# Altium project vme6U_carrier_Cyc_V_SoC.PrjPcb (part 8 of 8)

## Sheet Buffers.DiagrammaStrutturale.SchDoc
size 420 x 297 mm; Address1: Address1; Address2: Address2; Address3: Address3; Address4: Address4; SheetNumber: 1; Scale: 1:1; Разраб.: Иванов; Обозначение документа: АБВГ.123456.001 Э3; Пров.: Петров; Утв.: Сидоров; Наименование организации: ОАО "Концерн "МПО-Гидроприбор"; Перв. применение: АБВГ.123456.000; Наименование изделия 1: Плата; Наименование изделия 2: Схема электрическая; Наименование изделия 3: принципиальная; Нач. отд.: Нач. отд.; Фамилия нач. отд.: Сидоров
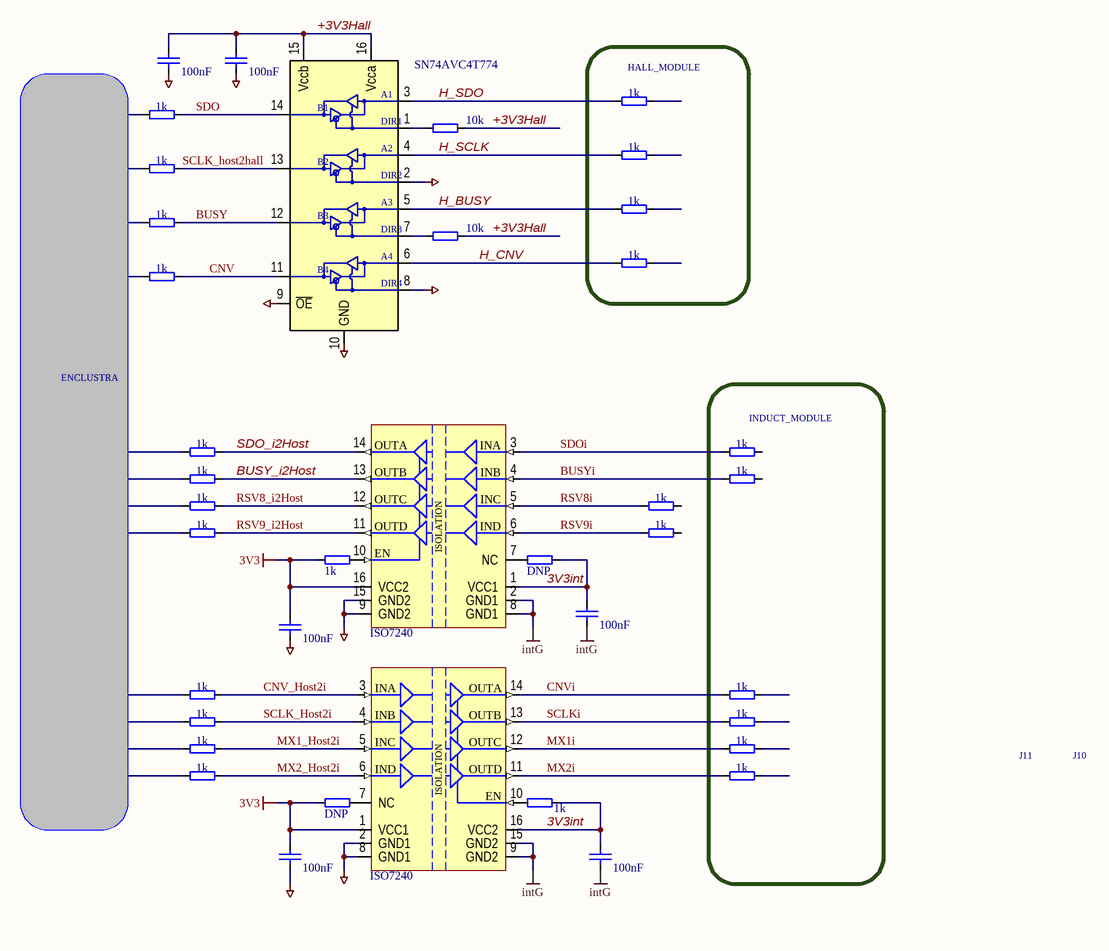
[diagram p27: Buffers.DiagrammaStrutturale.SchDoc]

### Parts
(Parts that share a designator on the sheet are numbered #1, #2 ... from top to bottom, then left to right.)
C?#1  100nF  [SMD0805CAP]
C?#2  100nF  [SMD0805CAP]
C?#3  100nF  [SMD0805CAP]
C?#4  100nF  [SMD0805CAP]
C?#5  100nF  [SMD0805CAP]
C?#6  100nF  [SMD0805CAP]
R?#1  1k  [SMD0805RES]
R?#2  1k  [SMD0805RES]
R?#3  10k  [SMD0805RES]
R?#4  1k  [SMD0805RES]
R?#5  1k  [SMD0805RES]
R?#6  1k  [SMD0805RES]
R?#7  1k  [SMD0805RES]
R?#8  10k  [SMD0805RES]
R?#9  1k  [SMD0805RES]
R?#10  1k  [SMD0805RES]
R?#11  1k  [SMD0805RES]
R?#12  1k  [SMD0805RES]
R?#13  1k  [SMD0805RES]
R?#14  1k  [SMD0805RES]
R?#15  1k  [SMD0805RES]
R?#16  1k  [SMD0805RES]
R?#17  1k  [SMD0805RES]
R?#18  1k  [SMD0805RES]
R?#19  1k  [SMD0805RES]
R?#20  DNP  [SMD0805RES]
R?#21  1k  [SMD0805RES]
R?#22  1k  [SMD0805RES]
R?#23  1k  [SMD0805RES]
R?#24  1k  [SMD0805RES]
R?#25  1k  [SMD0805RES]
R?#26  1k  [SMD0805RES]
R?#27  1k  [SMD0805RES]
R?#28  1k  [SMD0805RES]
R?#29  DNP  [SMD0805RES]
R?#30  1k  [SMD0805RES]
U?#1  SN74AVC4T774  [TSSOP-16]
U?#2  ISO7240  [SOIC127P1030X265-16N]
U?#3  ISO7240  [SOIC127P1030X265-16N]

### Blocks framed on the sheet
HALL_MODULE: R?#1 R?#4 R?#6 R?#9
INDUCT_MODULE: R?#12 R?#14 R?#22 R?#24 R?#26 R?#28

### Nets
3V3: C?#4.2 C?#5.2 R?#19.1 R?#29.1 U?#2.16(VCC2) U?#3.1(VCC1)
GND: C?#1.1 C?#2.1 C?#4.1 C?#5.1 U?#1.2(DIR2) U?#1.8(DIR4) U?#1.9(~{OE}) U?#1.10(GND) U?#2.9(GND2) U?#2.15(GND2) U?#3.2(GND1) U?#3.8(GND1)
intG: C?#3.1 C?#6.1 U?#2.2(GND1) U?#2.8(GND1) U?#3.9(GND2) U?#3.15(GND2)
3V3int: C?#3.2 C?#6.2 R?#20.2 R?#30.2 U?#2.1(VCC1) U?#3.16(VCC2)
+3V3Hall: C?#1.2 C?#2.2 R?#3.1 R?#8.1 U?#1.15(Vccb) U?#1.16(Vcca)
BUSY: R?#7.1 U?#1.12(B3)
BUSY_i2Host: R?#13.1 U?#2.13(OUTB)
BUSYi: R?#14.2 U?#2.4(INB)
CNV: R?#10.1 U?#1.11(B4)
CNV_Host2i: R?#21.1 U?#3.3(INA)
CNVi: R?#22.2 U?#3.14(OUTA)
H_BUSY: R?#6.2 U?#1.5(A3)
H_CNV: R?#9.2 U?#1.6(A4)
H_SCLK: R?#4.2 U?#1.4(A2)
H_SDO: R?#1.2 U?#1.3(A1)
MX1_Host2i: R?#25.1 U?#3.5(INC)
MX1i: R?#26.2 U?#3.12(OUTC)
MX2_Host2i: R?#27.1 U?#3.6(IND)
MX2i: R?#28.2 U?#3.11(OUTD)
RSV8_i2Host: R?#15.1 U?#2.12(OUTC)
RSV8i: R?#16.2 U?#2.5(INC)
RSV9_i2Host: R?#17.1 U?#2.11(OUTD)
RSV9i: R?#18.2 U?#2.6(IND)
SCLK_host2hall: R?#5.1 U?#1.13(B2)
SCLK_Host2i: R?#23.1 U?#3.4(INB)
SCLKi: R?#24.2 U?#3.13(OUTB)
SDO: R?#2.1 U?#1.14(B1)
SDO_i2Host: R?#11.1 U?#2.14(OUTA)
SDOi: R?#12.2 U?#2.3(INA)
NetR?#3_2: R?#3.2 U?#1.1(DIR1)
NetR?#8_2: R?#8.2 U?#1.7(DIR3)
NetR?#19_2: R?#19.2 U?#2.10(EN)
NetR?#20_1: R?#20.1 U?#2.7(NC)
NetR?#29_2: R?#29.2 U?#3.7(NC)
NetR?#30_1: R?#30.1 U?#3.10(EN)

Not connected (* = marked no-connect by the designer): R?#1 1; R?#2 2; R?#4 1; R?#5 2; R?#6 1; R?#7 2; R?#9 1; R?#10 2; R?#11 2; R?#12 1; R?#13 2; R?#14 1; R?#15 2; R?#16 1; R?#17 2; R?#18 1; R?#21 2; R?#22 1; R?#23 2; R?#24 1; R?#25 2; R?#26 1; R?#27 2; R?#28 1

### Notes on the sheet
- ENCLUSTRA
- J11
- J10
- Подп. и дата
- Инв. № дубл.
- Взам. инв. №
- Инв. № подл.
- Изм.
- Лист
- № докум.
- Подп.
- Дата
- Копировал
- Формат А3
- (in symbol ISO7240M) ISOLATION

### Library data of the parts
C?#1-C?#6 = C0805: Чип конденсатор 0805; Voltage: 25V; Vendor: Vishay; DielectricType: X5R; SMD Solders: 2; Solder Option: RM; Tolerance: 20%; Pkg: SMD0805; Device: Cap0805; Value: 100nF; Price: 2
R?#1-R?#18 R?#20-R?#29 = R0805: Чип резистор 0805; Vendor: Vishay; SMD Solders: 2; Solder Option: i; TC: 100ppm/C; Tolerance: 1%; Pkg: SMD0805; Pwr: 125mW; Device: Res0805; Price: 2
  R?#1 R?#2 R?#4-R?#7 R?#9-R?#18 R?#21-R?#28: Value: 1k
  R?#3 R?#8: Value: 10k
  R?#20 R?#29: Value: DNP
R?#19 R?#30 = R0805: Чип резистор 0805; Vendor: Vishay; SMD Solders: 2; Solder Option: RM; TC: 100ppm/C; Tolerance: 1%; Pkg: SMD0805; Pwr: 125mW; Device: Res0805; Price: 2; Value: 1k
U?#1 = SN74AVC4T774: Двунаправленный буфер; Pkg: TSSOP16; SMD Solders: 16; Solder Option: RM; THD Solders: 0; Vendor: Texas Instruments; Voltage: 1V1.. 3.6V  I/Os are 4.6-V Tolerant; Name to order: SN74AVC4T774PW; Device: SN74AVC4T774; Price: 300
U?#2 U?#3 = ISO7240M: Двунаправленный буфер; Pkg: SOIC16DW; SMD Solders: 16; Solder Option: RM; THD Solders: 0; Vendor: Texas Instruments; Voltage: 3V3 or 5V; Name to order: ISO7240MDWR; Current: 30; Device: ISO7240; Price: 3500

## Nets that join several sheets
3V3RF: RFCtl (11 pins), DCDC_Hall (L32.2), Integrator (14 pins), DCDC_DDS (L42.2), DCDC_Slow (L75.2)
+1V8MOD: main (TP1.1), cyc_v_som_B (J3.B52 J3.B76 J3.B108 J3.B128)
+2V5MOD: main (TP12.1), cyc_v_som_A (J3.A53 J3.A62 J3.A65 J3.A89), cyc_v_som_B (6 pins), cyc_v_som_C (6 pins), Si5395_CLK_GEN (20 pins)
+3.3VD: main (39 pins), cyc_v_som_A (J3.A38 J3.A41 J3.A74 J3.A77), ethernet_1gbe_ext_magn (R46.1 R77.1), ethernet_dual_100mbe_ext_magn (R82#1.1 R94.1), uart_adm3222 (C80.2 R62.2 U19#1.19), jtag (7 pins), sdcard_emmc (44 pins), U_can_phy (C106_U_can_phy#1.2 U9_U_can_phy#1.1), U_can_phy (C106_U_can_phy#2.2 U9_U_can_phy#2.1), U_SFPplusConn_0 (11 pins), U_SFPplusConn_1 (11 pins), U_SFPplusConn_2 (11 pins), U_SFPplusConn_3 (11 pins), Si5395_CLK_GEN (22 pins), power_REG104GA_1V8 (C148#1.2 C151#1.2 U36#1.1)
+3V3MOD: main (C128.2 TP11.1 U26#1.14), cyc_v_som_A (J3.A26 J3.A29 J3.A50 J3.A86), cyc_v_som_B (6 pins), cyc_v_som_C (J3.C96 J3.C103 J3.C136 J3.C143)
+5VME: cyc_v_som_A (10 pins), U_can_phy (C109_U_can_phy#1.2 C110_U_can_phy#1.2 U10_U_can_phy#1.1), U_can_phy (C109_U_can_phy#2.2 C110_U_can_phy#2.2 U10_U_can_phy#2.1), Si5395_CLK_GEN (R182#1.2), power_REG104GA_3V3 (C156.2 C157#1.2 U37#1.1), RFCtl (13 pins), DCDC_Hall (10 pins), RF_Ctl/RF_H/H_DCDC/DCP_H- (C7_DCP_H-.2 L17_DCP_H-.1 R19_DCP_H-.1 R25_DCP_H-.1), RF_Ctl/RF_i/i_DCDC/DCP_i- (C7_DCP_i-.2 L17_DCP_i-.1 R19_DCP_i-.1 R25_DCP_i-.1), RF_Ctl/RF_i/i_DCDC/DCP_i+ (C7_DCP_i+.2 L17_DCP_i+.1 R19_DCP_i+.1 R25_DCP_i+.1), DCDC_DDS (7 pins), RF_Ctl/RF_D/D_DCDC/DCP_D+ (C7_DCP_D+.2 L17_DCP_D+.1 R19_DCP_D+.1 R25_DCP_D+.1), RF_Ctl/RF_D/D_DCDC/DCP_D- (C7_DCP_D-.2 L17_DCP_D-.1 R19_DCP_D-.1 R25_DCP_D-.1), DCDC_Slow (15 pins), RF_Ctl/RF_S/S_DCDC/DCP_S+ (C7_DCP_S+.2 L17_DCP_S+.1 R19_DCP_S+.1 R25_DCP_S+.1), RF_Ctl/RF_S/S_DCDC/DCP_S- (C7_DCP_S-.2 L17_DCP_S-.1 R19_DCP_S-.1 R25_DCP_S-.1)
+12Vin: DCDC_Hall (7 pins), DCDC_int (5 pins), DCDC_DDS (Q19.2 R240.2), DCDC_Slow (7 pins)
intG: Integrator (37 pins), DCDC_int (35 pins), RF_Ctl/RF_i/i_DCDC/DCP_i- (C9_DCP_i-.2 C13_DCP_i-.2 U3_DCP_i-.13), RF_Ctl/RF_i/i_DCDC/DCP_i+ (C9_DCP_i+.2 C13_DCP_i+.2 U3_DCP_i+.13)
MGND: main (8 pins), ethernet_1gbe_ext_magn (C88#1.1 C89.1 J11.S1 J11.S2), ethernet_dual_100mbe_ext_magn (C111.2 C118.1 J13.S1 J13.S2), uart_adm3222 (J1#1.0)
POK_int: main (84 pins), cyc_v_som_A (29 pins), cyc_v_som_B (37 pins), cyc_v_som_C (41 pins), ethernet_1gbe_ext_magn (7 pins), ethernet_dual_100mbe_ext_magn (7 pins), uart_adm3222 (7 pins), jtag (C81#1.1 J2.10 R171.2 U20.2), sdcard_emmc (33 pins), U_can_phy (5 pins), U_can_phy (5 pins), Power_3V3_LDO (C133.1 C134.1 U28.2), U_SFPplusConn_0 (31 pins), U_SFPplusConn_1 (31 pins), U_SFPplusConn_2 (31 pins), U_SFPplusConn_3 (31 pins), Si5395_CLK_GEN (63 pins), power_REG104GA_1V8 (8 pins), power_REG104GA_3V3 (8 pins), RFCtl (38 pins), Hall (62 pins), DCDC_Hall (41 pins), RF_Ctl/RF_H/H_DCDC/DCP_H- (12 pins), Integrator (17 pins), DCDC_int (9 pins), RF_Ctl/RF_i/i_DCDC/DCP_i- (9 pins), RF_Ctl/RF_i/i_DCDC/DCP_i+ (9 pins), DDS (83 pins), DCDC_DDS (21 pins), RF_Ctl/RF_D/D_DCDC/DCP_D+ (12 pins), RF_Ctl/RF_D/D_DCDC/DCP_D- (12 pins), SlowChans (196 pins), DCDC_Slow (49 pins), RF_Ctl/RF_S/S_DCDC/DCP_S+ (12 pins), RF_Ctl/RF_S/S_DCDC/DCP_S- (12 pins)
VBUT: main (C132.2 R98#1.1), cyc_v_som_A (J3.A168)
3V3BATLDO: main (D4.1), Power_3V3_LDO (C134.2 R101#1.2 U28.5)
3V3DDS: DDS (31 pins), DCDC_DDS (Q24.3 R225.2)
3V3SL: SlowChans (106 pins), DCDC_Slow (Q41.3 R401.2)
12DDS: DDS (L38.2), DCDC_DDS (Q19.3 R216.2)
+3V3Hall: Hall (28 pins), DCDC_Hall (Q11.3 R82#2.2)
+5SL: SlowChans (6 pins), DCDC_Slow (Q44.3 R405.2)
+7_: DCDC_Slow (R513.2), RF_Ctl/RF_S/S_DCDC/DCP_S+ (C9_DCP_S+.2 C13_DCP_S+.2 U3_DCP_S+.13)
+7D: DCDC_DDS (Q21.2 R251.2 R525.1), RF_Ctl/RF_D/D_DCDC/DCP_D+ (C9_DCP_D+.2 C13_DCP_D+.2 U3_DCP_D+.13)
+7DDS: DDS (L35.2 L96.2), DCDC_DDS (Q21.3 R219.2)
+7H: DCDC_int (R314.2), RF_Ctl/RF_i/i_DCDC/DCP_i+ (C9_DCP_i+.1 C13_DCP_i+.1 U3_DCP_i+.12)
+7int: Integrator (L48.2 L99.2 L850.1), DCDC_int (Q29.3 R265.2)
+7SL: SlowChans (6 pins), DCDC_Slow (Q38.3 R394.2)
+12Hall: Hall (L28.2), DCDC_Hall (Q9.3 R67#2.2)
+12SL: SlowChans (L59.2 L70.2 L80.2), DCDC_Slow (Q37.3 R391.2)
+18Hall: Hall (L30.2), DCDC_Hall (Q5.3 R89#2.2)
+18int: Integrator (L46.2), DCDC_int (Q32.3 R321.2)
+18SL: SlowChans (L54.2 L65.2 L76.2), DCDC_Slow (Q51.3 R383.2)
-7_: DCDC_Slow (Q45.2 R388.1 R452.2), RF_Ctl/RF_S/S_DCDC/DCP_S- (C9_DCP_S-.1 C13_DCP_S-.1 U3_DCP_S-.12)
-7D: DCDC_DDS (Q15.2 R221.2 R231.1), RF_Ctl/RF_D/D_DCDC/DCP_D- (C9_DCP_D-.1 C13_DCP_D-.1 U3_DCP_D-.12)
-7DDS: DDS (L37.2 L93.2), DCDC_DDS (Q15.3 R222.2)
-7H: DCDC_Hall (Q4.2 R78#2.2 R101#2.1), RF_Ctl/RF_H/H_DCDC/DCP_H- (C9_DCP_H-.1 C13_DCP_H-.1 U3_DCP_H-.12)
-7Hall: Hall (L27.2 L86.2), DCDC_Hall (Q4.3 R6.2)
-7i: DCDC_int (Q26.2 R272.2 R274.2), RF_Ctl/RF_i/i_DCDC/DCP_i- (C9_DCP_i-.1 C13_DCP_i-.1 U3_DCP_i-.12)
-7int: Integrator (L50.2 L95.2), DCDC_int (Q26.3 R267.2)
-7SL: SlowChans (5 pins), DCDC_Slow (Q45.3 R408.2)
-18Hall: Hall (L29.2), DCDC_Hall (Q7.3 R114#2.2)
-18int: Integrator (L47.2), DCDC_int (Q31.3 R276.2)
-18SL: SlowChans (L55.2 L66.2 L77.2), DCDC_Slow (Q49.3 R386.2)
~{En}: RFCtl (U70.8 U70.13), DCDC_Hall (Q13.1), DCDC_int (R260.1), DCDC_DDS (Q16.1), DCDC_Slow (Q47.1)
BOOT_MODE0: main (J10.7), cyc_v_som_A (J3.A126)
BOOT_MODE1: main (J10.8), cyc_v_som_A (J3.A112)
CAN0_G: main (J9.3), U_can_phy (L15_U_can_phy#1.1)
CAN0_H: main (J9.7), U_can_phy (L14_U_can_phy#1.1)
CAN0_L: main (J9.2), U_can_phy (L14_U_can_phy#1.4)
CAN0_RX: cyc_v_som_A (J3.A88), U_can_phy (R29_U_can_phy#1.2)
CAN0_TX: cyc_v_som_A (J3.A90), U_can_phy (R33_U_can_phy#1.2)
CAN1_G: main (J9.4), U_can_phy (L15_U_can_phy#2.1)
CAN1_H: main (J9.8), U_can_phy (L14_U_can_phy#2.1)
CAN1_L: main (J9.1), U_can_phy (L14_U_can_phy#2.4)
CAN1_RX: cyc_v_som_A (J3.A104), U_can_phy (R29_U_can_phy#2.2)
CAN1_TX: cyc_v_som_A (J3.A106), U_can_phy (R33_U_can_phy#2.2)
Clock_hDCP-: RFCtl (U74.3), RF_Ctl/RF_H/H_DCDC/DCP_H- (Q10_DCP_H-.1 R19_DCP_H-.2)
Clock_iDCP+: RFCtl (U69.3), RF_Ctl/RF_i/i_DCDC/DCP_i+ (Q10_DCP_i+.1 R19_DCP_i+.2)
Clock_iDCP-: RFCtl (U69.6), RF_Ctl/RF_i/i_DCDC/DCP_i- (Q10_DCP_i-.1 R19_DCP_i-.2)
D_POK: DDS (R810.2), DCDC_DDS (7 pins)
DDS_CLK_N: Si5395_CLK_GEN (U35.23), DDS (C79#2.1 R258.1)
DDS_CLK_P: Si5395_CLK_GEN (U35.24), DDS (C76#2.1 R258.2)
EN_3V3: main (U26#1.6), RFCtl (J45.1)
ETH0_A_N: cyc_v_som_A (J3.A163), ethernet_1gbe_ext_magn (L13.3 U18.1)
ETH0_A_P: cyc_v_som_A (J3.A165), ethernet_1gbe_ext_magn (L13.2 U18.3)
ETH0_B_N: cyc_v_som_A (J3.A157), ethernet_1gbe_ext_magn (L13.6 U18.4)
ETH0_B_P: cyc_v_som_A (J3.A159), ethernet_1gbe_ext_magn (L13.5 U18.6)
ETH0_C_N: cyc_v_som_A (J3.A151), ethernet_1gbe_ext_magn (L13.9 U21#1.1)
ETH0_C_P: cyc_v_som_A (J3.A153), ethernet_1gbe_ext_magn (L13.8 U21#1.3)
ETH0_CTREF: cyc_v_som_A (J3.A155), ethernet_1gbe_ext_magn (5 pins)
ETH0_D_N: cyc_v_som_A (J3.A145), ethernet_1gbe_ext_magn (L13.12 U21#1.4)
ETH0_D_P: cyc_v_som_A (J3.A147), ethernet_1gbe_ext_magn (L13.11 U21#1.6)
ETH0_LED1: cyc_v_som_A (J3.A149), ethernet_1gbe_ext_magn (J11.9)
ETH0_LED2: cyc_v_som_A (J3.A161), ethernet_1gbe_ext_magn (J11.11)
ETH1_CTREF: cyc_v_som_A (J3.A154), ethernet_dual_100mbe_ext_magn (5 pins)
ETH1_LED1: cyc_v_som_A (J3.A160), ethernet_dual_100mbe_ext_magn (J13.9B)
ETH1_LED2: cyc_v_som_A (J3.A148), ethernet_dual_100mbe_ext_magn (J13.9A)
ETH1A_RX_N: cyc_v_som_A (J3.A156), ethernet_dual_100mbe_ext_magn (L8.6 U22.4)
ETH1A_RX_P: cyc_v_som_A (J3.A158), ethernet_dual_100mbe_ext_magn (L8.5 U22.6)
ETH1A_TX_N: cyc_v_som_A (J3.A162), ethernet_dual_100mbe_ext_magn (L8.3 U22.1)
ETH1A_TX_P: cyc_v_som_A (J3.A164), ethernet_dual_100mbe_ext_magn (L8.2 U22.3)
ETH1B_RX_N: cyc_v_som_A (J3.A144), ethernet_dual_100mbe_ext_magn (L8.12 U23.4)
ETH1B_RX_P: cyc_v_som_A (J3.A146), ethernet_dual_100mbe_ext_magn (L8.11 U23.6)
ETH1B_TX_N: cyc_v_som_A (J3.A150), ethernet_dual_100mbe_ext_magn (L8.9 U23.1)
ETH1B_TX_P: cyc_v_som_A (J3.A152), ethernet_dual_100mbe_ext_magn (L8.8 U23.3)
FCKO_N: main (C187.1), cyc_v_som_C (J3.C163)
FCKO_P: main (C186.1), cyc_v_som_C (J3.C161)
FPGA_CONFDONE: main (U26#1.1), cyc_v_som_A (J3.A130)
GPIO51: main (TP2.1), cyc_v_som_A (J3.A82)
GPIO52: main (TP4.1), cyc_v_som_A (J3.A84)
GPIO57: main (R35.1), cyc_v_som_A (J3.A98)
GPIO58: main (TP6.1), cyc_v_som_A (J3.A100)
GPIO63: main (TP8.1), cyc_v_som_A (J3.A92)
GPIO64: main (TP10.1), cyc_v_som_A (J3.A94)
GTP_REF0.IO_N: cyc_v_som_B (J3.B6), Si5395_CLK_GEN (C197.2)
GTP_REF0.IO_P: cyc_v_som_B (J3.B4), Si5395_CLK_GEN (C196#1.2)
GTP_REF1.IO_N: cyc_v_som_B (J3.B12), Si5395_CLK_GEN (C199.2)
GTP_REF1.IO_P: cyc_v_som_B (J3.B10), Si5395_CLK_GEN (C198.2)
GTP_REF2.IO_N: cyc_v_som_B (J3.B5), Si5395_CLK_GEN (C201#1.2)
GTP_REF2.IO_P: cyc_v_som_B (J3.B3), Si5395_CLK_GEN (C200.2)
H_POK: Hall (R527.1), DCDC_Hall (8 pins)
HPS_PORn: main (R158.2 U27.1), cyc_v_som_A (J3.A132), sdcard_emmc (U24#1.M5)
HPS_RSTn: main (C119.1 J15.1 J15.2 R159.2), cyc_v_som_A (J3.A124), jtag (R71.1)
IN2_N: main (C187.2), Si5395_CLK_GEN (R134.1 U35.15)
IN2_P: main (C186.2), Si5395_CLK_GEN (R134.2 U35.14)
INT_SFP01: main (R114#1.1 U32.13), cyc_v_som_A (J3.A57)
INT_SFP23: main (R113#1.1 U31#1.13), cyc_v_som_A (J3.A55)
IO_AL1: cyc_v_som_A (J3.A15), Si5395_CLK_GEN (U35.12)
IO_AL2: cyc_v_som_A (J3.A17), Si5395_CLK_GEN (U35.18)
IO_AL3: cyc_v_som_A (J3.A19), Si5395_CLK_GEN (U35.16)
IO_AL4: cyc_v_som_A (J3.A21), Si5395_CLK_GEN (U35.19)
IO_AL5: cyc_v_som_A (J3.A25), Si5395_CLK_GEN (R127.2 U39.7)
IO_AL6: cyc_v_som_A (J3.A27), Si5395_CLK_GEN (U35.47)
IO_AL7: cyc_v_som_A (J3.A31), Si5395_CLK_GEN (R128.2 U39.8)
IO_AL8: cyc_v_som_A (J3.A33), Si5395_CLK_GEN (U39.2)
IO_AL9: cyc_v_som_A (J3.A37), Si5395_CLK_GEN (R125#1.1)
IO_AL10: cyc_v_som_A (J3.A39), Si5395_CLK_GEN (R123#1.1)
IO_AL11: main (6 pins), cyc_v_som_A (J3.A49)
IO_AL12: main (6 pins), cyc_v_som_A (J3.A51)
IO_AL15: main (R36.1), cyc_v_som_A (J3.A61)
IO_AL16: main (R34.1), cyc_v_som_A (J3.A63)
IO_AL25: cyc_v_som_A (J3.A85), Si5395_CLK_GEN (R129#1.2)
IO_AR11: cyc_v_som_A (J3.A46), Si5395_CLK_GEN (R147.2)
IO_BL3: cyc_v_som_B (J3.B57), SlowChans (R361.2)
IO_BL4: cyc_v_som_B (J3.B59), SlowChans (R363.2)
IO_BL5: cyc_v_som_B (J3.B75), SlowChans (R364.2)
IO_BL6: cyc_v_som_B (J3.B77), SlowChans (R366.2)
IO_BL7: cyc_v_som_B (J3.B81), SlowChans (R369.2)
IO_BL8: cyc_v_som_B (J3.B83), SlowChans (R371.2)
IO_BL9: cyc_v_som_B (J3.B87), SlowChans (R373.2)
IO_BL10: cyc_v_som_B (J3.B89), SlowChans (R376.2)
IO_BL11: cyc_v_som_B (J3.B91), SlowChans (R348.2)
IO_BL12: cyc_v_som_B (J3.B93), SlowChans (R352.2)
IO_BL13: cyc_v_som_B (J3.B97), SlowChans (R354.2)
IO_BL14: cyc_v_som_B (J3.B99), SlowChans (R355.2)
IO_BL15: cyc_v_som_B (J3.B101), SlowChans (R399.2)
IO_BL16: cyc_v_som_B (J3.B103), SlowChans (R406.2)
IO_BL17: cyc_v_som_B (J3.B107), Integrator (R286.1)
IO_BL18: cyc_v_som_B (J3.B109), Integrator (R285.1)
IO_BL19: cyc_v_som_B (J3.B111), Integrator (R288.1)
IO_BL20: cyc_v_som_B (J3.B113), DDS (R245.2)
IO_BL21: cyc_v_som_B (J3.B117), DDS (R256.2)
IO_BL22: cyc_v_som_B (J3.B119), DDS (R237.2)
IO_BL23: cyc_v_som_B (J3.B123), DDS (R254.2)
IO_BL24: cyc_v_som_B (J3.B125), DDS (R241.1)
IO_BL25: cyc_v_som_B (J3.B129), DDS (R235.2)
IO_BL26: cyc_v_som_B (J3.B131), DDS (R230.2)
IO_BL27: cyc_v_som_B (J3.B133), DDS (R220.2)
IO_BL28: cyc_v_som_B (J3.B135), DDS (R233.2)
IO_BL29: cyc_v_som_B (J3.B139), DDS (R242.2)
IO_BL30: cyc_v_som_B (J3.B141), DDS (R239.2)
IO_BL31: cyc_v_som_B (J3.B145), DDS (R234.2)
IO_BL32: cyc_v_som_B (J3.B147), DDS (R223.2)
IO_BL33: cyc_v_som_B (J3.B151), DDS (R259.2)
IO_BL34: cyc_v_som_B (J3.B153), DDS (R226.2)
IO_BL35: cyc_v_som_B (J3.B157), DDS (R218.2)
IO_BL36: cyc_v_som_B (J3.B159), DDS (R252.2)
IO_BL37: cyc_v_som_B (J3.B163), DDS (R247.2)
IO_BL38: cyc_v_som_B (J3.B165), DDS (R253.2)
IO_BR16: cyc_v_som_B (J3.B112), DDS (R244.2)
IO_BR17: cyc_v_som_B (J3.B114), DDS (R248.2)
IO_BR18: cyc_v_som_B (J3.B116), DDS (R224.2)
IO_BR19: cyc_v_som_B (J3.B120), DDS (R249.2)
IO_BR20: cyc_v_som_B (J3.B122), DDS (R228.2)
IO_BR21: cyc_v_som_B (J3.B124), Hall (R187.2)
IO_BR22: cyc_v_som_B (J3.B126), Hall (R173#2.2)
IO_BR23: cyc_v_som_B (J3.B130), Hall (R198.2)
IO_BR24: cyc_v_som_B (J3.B132), Hall (R197.2)
IO_BR25: cyc_v_som_B (J3.B136), Hall (R103#2.2)
IO_BR26: cyc_v_som_B (J3.B138), Hall (R102.2)
IO_BR27: cyc_v_som_B (J3.B142), Hall (R113#2.2)
IO_BR28: cyc_v_som_B (J3.B144), Hall (R110#2.2)
IO_BR29: cyc_v_som_B (J3.B148), Hall (R80#2.2)
IO_BR30: cyc_v_som_B (J3.B150), Hall (R52.2)
IO_BR31: cyc_v_som_B (J3.B154), Hall (R97#2.2)
IO_BR32: cyc_v_som_B (J3.B156), Hall (R83#2.2)
IO_BR33: cyc_v_som_B (J3.B160), Hall (R125#2.2)
IO_BR34: cyc_v_som_B (J3.B162), Hall (R117#2.2)
IO_BR35: cyc_v_som_B (J3.B164), Hall (R168#2.2)
IO_BR36: cyc_v_som_B (J3.B166), Hall (R135#2.2)
IO_CL21: main (P1.18), cyc_v_som_C (J3.C115)
IO_CL22: main (P1.20), cyc_v_som_C (J3.C117)
IO_CL23: main (P1.24), cyc_v_som_C (J3.C119)
IO_CL24: main (P1.26), cyc_v_som_C (J3.C121)
IO_CL25: main (P1.28), cyc_v_som_C (J3.C125)
IO_CL26: main (P1.30), cyc_v_som_C (J3.C127)
IO_CL27: main (P1.34 R142.2), cyc_v_som_C (J3.C129)
IO_CL28: main (P1.36 R144.2), cyc_v_som_C (J3.C131)
IO_CL29: main (P1.38 R151.2), cyc_v_som_C (J3.C135)
IO_CL30: main (P1.40 R152.2), cyc_v_som_C (J3.C137)
IO_CL31: main (P1.44), cyc_v_som_C (J3.C139)
IO_CL32: main (P1.46), cyc_v_som_C (J3.C141)
IO_CL33: main (P1.48), cyc_v_som_C (J3.C145)
IO_CL34: main (P1.50), cyc_v_som_C (J3.C147)
IO_CL35: main (P1.54), cyc_v_som_C (J3.C151)
IO_CL36: main (P1.56), cyc_v_som_C (J3.C153)
IO_CL37: main (P1.58), cyc_v_som_C (J3.C157)
IO_CL38: main (P1.60), cyc_v_som_C (J3.C159)
IO_CL_FX1: cyc_v_som_C (J3.C3), SlowChans (R502.2)
IO_CL_FX2: cyc_v_som_C (J3.C5), SlowChans (R503.2)
IO_CL_FX3: cyc_v_som_C (J3.C7), SlowChans (R506.2)
IO_CL_FX4: cyc_v_som_C (J3.C9), SlowChans (R507.2)
IO_CL_FX5: cyc_v_som_C (J3.C21), SlowChans (R508.2)
IO_CL_FX6: cyc_v_som_C (J3.C25), SlowChans (R509.2)
IO_CL_FX7: cyc_v_som_C (J3.C29), SlowChans (R492.2)
IO_CL_FX8: cyc_v_som_C (J3.C33), SlowChans (R493.2)
IO_CL_FX9: cyc_v_som_C (J3.C37), SlowChans (R494.2)
IO_CL_FX10: cyc_v_som_C (J3.C41), SlowChans (R495.2)
IO_CL_FX11: cyc_v_som_C (J3.C45), RFCtl (U70.11)
IO_CR1: cyc_v_som_C (J3.C66), SlowChans (R403.2)
IO_CR2: cyc_v_som_C (J3.C68), SlowChans (R409.2)
IO_CR3: cyc_v_som_C (J3.C72), SlowChans (R414.2)
IO_CR4: cyc_v_som_C (J3.C74), SlowChans (R415.1)
IO_CR5: cyc_v_som_C (J3.C78), SlowChans (R417.2)
IO_CR6: cyc_v_som_C (J3.C80), SlowChans (R420.2)
IO_CR7: cyc_v_som_C (J3.C82), SlowChans (R382.2)
IO_CR8: cyc_v_som_C (J3.C84), SlowChans (R384.2)
IO_CR9: cyc_v_som_C (J3.C88), SlowChans (R389.2)
IO_CR10: cyc_v_som_C (J3.C90), SlowChans (R393.2)
IO_CR11: cyc_v_som_C (J3.C92), SlowChans (R444.2)
IO_CR12: cyc_v_som_C (J3.C94), SlowChans (R447.2)
IO_CR13: cyc_v_som_C (J3.C98), SlowChans (R448.2)
IO_CR14: cyc_v_som_C (J3.C100), SlowChans (R450.2)
IO_CR15: cyc_v_som_C (J3.C102), SlowChans (R435.2)
IO_CR16: cyc_v_som_C (J3.C104), SlowChans (R439.2)
IO_CR17: cyc_v_som_C (J3.C108), SlowChans (R441.2)
IO_CR18: cyc_v_som_C (J3.C110), SlowChans (R443.2)
IO_CR19: cyc_v_som_C (J3.C112), SlowChans (R421.2)
IO_CR20: cyc_v_som_C (J3.C114), SlowChans (R426.2)
IO_CR21: main (P1.17), cyc_v_som_C (J3.C118)
IO_CR22: main (P1.19), cyc_v_som_C (J3.C120)
IO_CR23: main (P1.23), cyc_v_som_C (J3.C122)
IO_CR24: main (P1.25), cyc_v_som_C (J3.C124)
IO_CR25: main (P1.27), cyc_v_som_C (J3.C128)
IO_CR26: main (P1.29), cyc_v_som_C (J3.C130)
IO_CR27: main (P1.33), cyc_v_som_C (J3.C132)
IO_CR28: main (P1.35), cyc_v_som_C (J3.C134)
IO_CR29: main (P1.37), cyc_v_som_C (J3.C138)
IO_CR30: main (P1.39), cyc_v_som_C (J3.C140)
IO_CR31: main (P1.43), cyc_v_som_C (J3.C142)
IO_CR32: main (P1.45), cyc_v_som_C (J3.C144)
IO_CR33: cyc_v_som_C (J3.C148), Si5395_CLK_GEN (C193#1.2)
IO_CR34: cyc_v_som_C (J3.C150), Si5395_CLK_GEN (C195#1.2)
IO_CR35: main (P1.47), cyc_v_som_C (J3.C154)
IO_CR36: main (P1.49), cyc_v_som_C (J3.C156)
IO_CR37: main (P1.53), cyc_v_som_C (J3.C160)
IO_CR38: main (P1.55), cyc_v_som_C (J3.C162)
IO_CR39: main (P1.57), cyc_v_som_C (J3.C164)
IO_CR40: main (P1.59), cyc_v_som_C (J3.C166)
IO_CR_FX1: cyc_v_som_C (J3.C4), SlowChans (R428.2)
IO_CR_FX2: cyc_v_som_C (J3.C6), SlowChans (R430.2)
IO_CR_FX3: cyc_v_som_C (J3.C10), SlowChans (R481.2)
IO_CR_FX4: cyc_v_som_C (J3.C12), SlowChans (R485.2)
IO_CR_FX5: cyc_v_som_C (J3.C24), SlowChans (R486.2)
IO_CR_FX6: cyc_v_som_C (J3.C28), SlowChans (R487.2)
IO_CR_FX7: cyc_v_som_C (J3.C32), SlowChans (R472.2)
IO_CR_FX8: cyc_v_som_C (J3.C36), SlowChans (R477.2)
IO_CR_FX9: cyc_v_som_C (J3.C40), SlowChans (R478.2)
IO_CR_FX10: cyc_v_som_C (J3.C44), SlowChans (R479.2)
IO_CR_FX11: cyc_v_som_C (J3.C48), SlowChans (R453.2)
IO_CR_FX12: cyc_v_som_C (J3.C50), SlowChans (R460.2)
IO_CR_FX13: cyc_v_som_C (J3.C54), SlowChans (R463.2)
IO_CR_FX14: cyc_v_som_C (J3.C56), SlowChans (R465.2)
IO_CR_FX15: cyc_v_som_C (J3.C60), SlowChans (R500.2)
IO_CR_FX16: cyc_v_som_C (J3.C62), SlowChans (R501.2)
iPOK: Integrator (R850.2), DCDC_int (7 pins)
JTAG_TCK: cyc_v_som_A (J3.A123), jtag (R73.1)
JTAG_TDI: cyc_v_som_A (J3.A117), jtag (R74.1)
JTAG_TDO: cyc_v_som_A (J3.A121), jtag (R76#1.1)
JTAG_TMS: cyc_v_som_A (J3.A119), jtag (R75.1)
MGT_RX8.IO_N: main (P1.5), cyc_v_som_C (J3.C20)
MGT_RX8.IO_P: main (P1.3), cyc_v_som_C (J3.C16)
MGT_TX6_N: main (C190.2), cyc_v_som_B (J3.B63)
MGT_TX6_P: main (C159#1.2), cyc_v_som_B (J3.B65)
MGT_TX8.IO_N: main (P1.6), cyc_v_som_C (J3.C17)
MGT_TX8.IO_P: main (P1.4), cyc_v_som_C (J3.C13)
ModDef_SFP0: main (U32.5), U_SFPplusConn_0 (J17_U_SFPplusConn_0.6 R108_U_SFPplusConn_0.8)
ModDef_SFP1: main (U32.10), U_SFPplusConn_1 (J17_U_SFPplusConn_1.6 R108_U_SFPplusConn_1.8)
ModDef_SFP2: main (U31#1.5), U_SFPplusConn_2 (J17_U_SFPplusConn_2.6 R108_U_SFPplusConn_2.8)
ModDef_SFP3: main (U31#1.10), U_SFPplusConn_3 (J17_U_SFPplusConn_3.6 R108_U_SFPplusConn_3.8)
NetC145#1_1: Si5395_CLK_GEN (R180.1), power_REG104GA_1V8 (C145#1.1 U36#1.5)
NetC146#1_2: Si5395_CLK_GEN (R179.2), power_REG104GA_1V8 (5 pins)
NetC153#1_1: Si5395_CLK_GEN (R181#1.2), power_REG104GA_3V3 (C153#1.1 C155.2 U37#1.2)
NetC154#1_1: Si5395_CLK_GEN (R182#1.1), power_REG104GA_3V3 (C154#1.1 U37#1.5)
NetQ10_DCP_D+_1: RF_Ctl/RF_D/D_DCDC/DCP_D+ (Q10_DCP_D+.1 R19_DCP_D+.2), RF_Ctl/RF_D/D_DCDC/DCP_D- (Q10_DCP_D-.1 R19_DCP_D-.2)
NetQ10_DCP_S+_1: RF_Ctl/RF_S/S_DCDC/DCP_S+ (Q10_DCP_S+.1 R19_DCP_S+.2), RF_Ctl/RF_S/S_DCDC/DCP_S- (Q10_DCP_S-.1 R19_DCP_S-.2)
PWR_EN: main (C127#1.2), cyc_v_som_A (J3.A10)
PWR_GOOD: main (U26#1.3), cyc_v_som_A (J3.A12)
QBR_N: main (P1.12 TP13.1), cyc_v_som_A (J3.A45)
QBR_P: main (P1.14 TP14.1), cyc_v_som_A (J3.A43)
RateSel0_SFP0: main (U33.4), U_SFPplusConn_0 (J17_U_SFPplusConn_0.7 R108_U_SFPplusConn_0.7)
RateSel0_SFP1: main (U33.6), U_SFPplusConn_1 (J17_U_SFPplusConn_1.7 R108_U_SFPplusConn_1.7)
RateSel0_SFP2: main (U33.9), U_SFPplusConn_2 (J17_U_SFPplusConn_2.7 R108_U_SFPplusConn_2.7)
RateSel0_SFP3: main (U33.11), U_SFPplusConn_3 (J17_U_SFPplusConn_3.7 R108_U_SFPplusConn_3.7)
RateSel1_SFP0: main (U33.5), U_SFPplusConn_0 (J17_U_SFPplusConn_0.9 R108_U_SFPplusConn_0.5)
RateSel1_SFP1: main (U33.7), U_SFPplusConn_1 (J17_U_SFPplusConn_1.9 R108_U_SFPplusConn_1.5)
RateSel1_SFP2: main (U33.10), U_SFPplusConn_2 (J17_U_SFPplusConn_2.9 R108_U_SFPplusConn_2.5)
RateSel1_SFP3: main (U33.12), U_SFPplusConn_3 (J17_U_SFPplusConn_3.9 R108_U_SFPplusConn_3.5)
RxLos_SFP0: main (U32.4), U_SFPplusConn_0 (J17_U_SFPplusConn_0.8 R108_U_SFPplusConn_0.6)
RxLos_SFP1: main (U32.9), U_SFPplusConn_1 (J17_U_SFPplusConn_1.8 R108_U_SFPplusConn_1.6)
RxLos_SFP2: main (U31#1.4), U_SFPplusConn_2 (J17_U_SFPplusConn_2.8 R108_U_SFPplusConn_2.6)
RxLos_SFP3: main (U31#1.9), U_SFPplusConn_3 (J17_U_SFPplusConn_3.8 R108_U_SFPplusConn_3.6)
SDIO_CLK: cyc_v_som_A (J3.A91), sdcard_emmc (U25.9)
SDIO_CMD: cyc_v_som_A (J3.A93), sdcard_emmc (U25.4)
SDIO_D0: cyc_v_som_A (J3.A95), sdcard_emmc (U25.6)
SDIO_D1: cyc_v_som_A (J3.A97), sdcard_emmc (U25.7)
SDIO_D2: cyc_v_som_A (J3.A101), sdcard_emmc (U25.1)
SDIO_D3: cyc_v_som_A (J3.A103), sdcard_emmc (U25.3)
SDIO_SEL: main (J10.5), sdcard_emmc (R89#1.1 U25.24)
SFP_I2C_0.SCL: main (U30#1.6), U_SFPplusConn_0 (J17_U_SFPplusConn_0.5 R107_U_SFPplusConn_0.5)
SFP_I2C_0.SDA: main (U30#1.5), U_SFPplusConn_0 (J17_U_SFPplusConn_0.4 R107_U_SFPplusConn_0.6)
SFP_I2C_1.SCL: main (U30#1.9), U_SFPplusConn_1 (J17_U_SFPplusConn_1.5 R107_U_SFPplusConn_1.5)
SFP_I2C_1.SDA: main (U30#1.8), U_SFPplusConn_1 (J17_U_SFPplusConn_1.4 R107_U_SFPplusConn_1.6)
SFP_I2C_2.SCL: main (U30#1.13), U_SFPplusConn_2 (J17_U_SFPplusConn_2.5 R107_U_SFPplusConn_2.5)
SFP_I2C_2.SDA: main (U30#1.12), U_SFPplusConn_2 (J17_U_SFPplusConn_2.4 R107_U_SFPplusConn_2.6)
SFP_I2C_3.SCL: main (U30#1.16), U_SFPplusConn_3 (J17_U_SFPplusConn_3.5 R107_U_SFPplusConn_3.5)
SFP_I2C_3.SDA: main (U30#1.15), U_SFPplusConn_3 (J17_U_SFPplusConn_3.4 R107_U_SFPplusConn_3.6)
SFP_IO_0.TxDis: main (U32.6), U_SFPplusConn_0 (J17_U_SFPplusConn_0.3 R107_U_SFPplusConn_0.7)
SFP_IO_0.TxFault: main (U32.7), U_SFPplusConn_0 (J17_U_SFPplusConn_0.2 R107_U_SFPplusConn_0.8)
SFP_IO_1.TxDis: main (U32.11), U_SFPplusConn_1 (J17_U_SFPplusConn_1.3 R107_U_SFPplusConn_1.7)
SFP_IO_1.TxFault: main (U32.12), U_SFPplusConn_1 (J17_U_SFPplusConn_1.2 R107_U_SFPplusConn_1.8)
SFP_IO_2.TxDis: main (U31#1.6), U_SFPplusConn_2 (J17_U_SFPplusConn_2.3 R107_U_SFPplusConn_2.7)
SFP_IO_2.TxFault: main (U31#1.7), U_SFPplusConn_2 (J17_U_SFPplusConn_2.2 R107_U_SFPplusConn_2.8)
SFP_IO_3.TxDis: main (U31#1.11), U_SFPplusConn_3 (J17_U_SFPplusConn_3.3 R107_U_SFPplusConn_3.7)
SFP_IO_3.TxFault: main (U31#1.12), U_SFPplusConn_3 (J17_U_SFPplusConn_3.2 R107_U_SFPplusConn_3.8)
SFP_RX_0.IO_N: cyc_v_som_B (J3.B20), U_SFPplusConn_0 (J17_U_SFPplusConn_0.13)
SFP_RX_0.IO_P: cyc_v_som_B (J3.B16), U_SFPplusConn_0 (J17_U_SFPplusConn_0.12)
SFP_RX_1.IO_N: cyc_v_som_B (J3.B44), U_SFPplusConn_1 (J17_U_SFPplusConn_1.13)
SFP_RX_1.IO_P: cyc_v_som_B (J3.B40), U_SFPplusConn_1 (J17_U_SFPplusConn_1.12)
SFP_RX_2.IO_N: cyc_v_som_B (J3.B50), U_SFPplusConn_2 (J17_U_SFPplusConn_2.13)
SFP_RX_2.IO_P: cyc_v_som_B (J3.B48), U_SFPplusConn_2 (J17_U_SFPplusConn_2.12)
SFP_RX_3.IO_N: cyc_v_som_B (J3.B56), U_SFPplusConn_3 (J17_U_SFPplusConn_3.13)
SFP_RX_3.IO_P: cyc_v_som_B (J3.B54), U_SFPplusConn_3 (J17_U_SFPplusConn_3.12)
SFP_TX_0.IO_N: cyc_v_som_B (J3.B17), U_SFPplusConn_0 (J17_U_SFPplusConn_0.19)
SFP_TX_0.IO_P: cyc_v_som_B (J3.B13), U_SFPplusConn_0 (J17_U_SFPplusConn_0.18)
SFP_TX_1.IO_N: cyc_v_som_B (J3.B41), U_SFPplusConn_1 (J17_U_SFPplusConn_1.19)
SFP_TX_1.IO_P: cyc_v_som_B (J3.B37), U_SFPplusConn_1 (J17_U_SFPplusConn_1.18)
SFP_TX_2.IO_N: cyc_v_som_B (J3.B47), U_SFPplusConn_2 (J17_U_SFPplusConn_2.19)
SFP_TX_2.IO_P: cyc_v_som_B (J3.B45), U_SFPplusConn_2 (J17_U_SFPplusConn_2.18)
SFP_TX_3.IO_N: cyc_v_som_B (J3.B53), U_SFPplusConn_3 (J17_U_SFPplusConn_3.19)
SFP_TX_3.IO_P: cyc_v_som_B (J3.B51), U_SFPplusConn_3 (J17_U_SFPplusConn_3.18)
UART_RX: cyc_v_som_A (J3.A105), uart_adm3222 (R66.1)
UART_TX: cyc_v_som_A (J3.A107), uart_adm3222 (R64.1)